# Altium schematic sheet TF_CARD&USB.SchDoc
size A3; Revision: 1.0; SheetNumber: 6; SheetTotal: 7
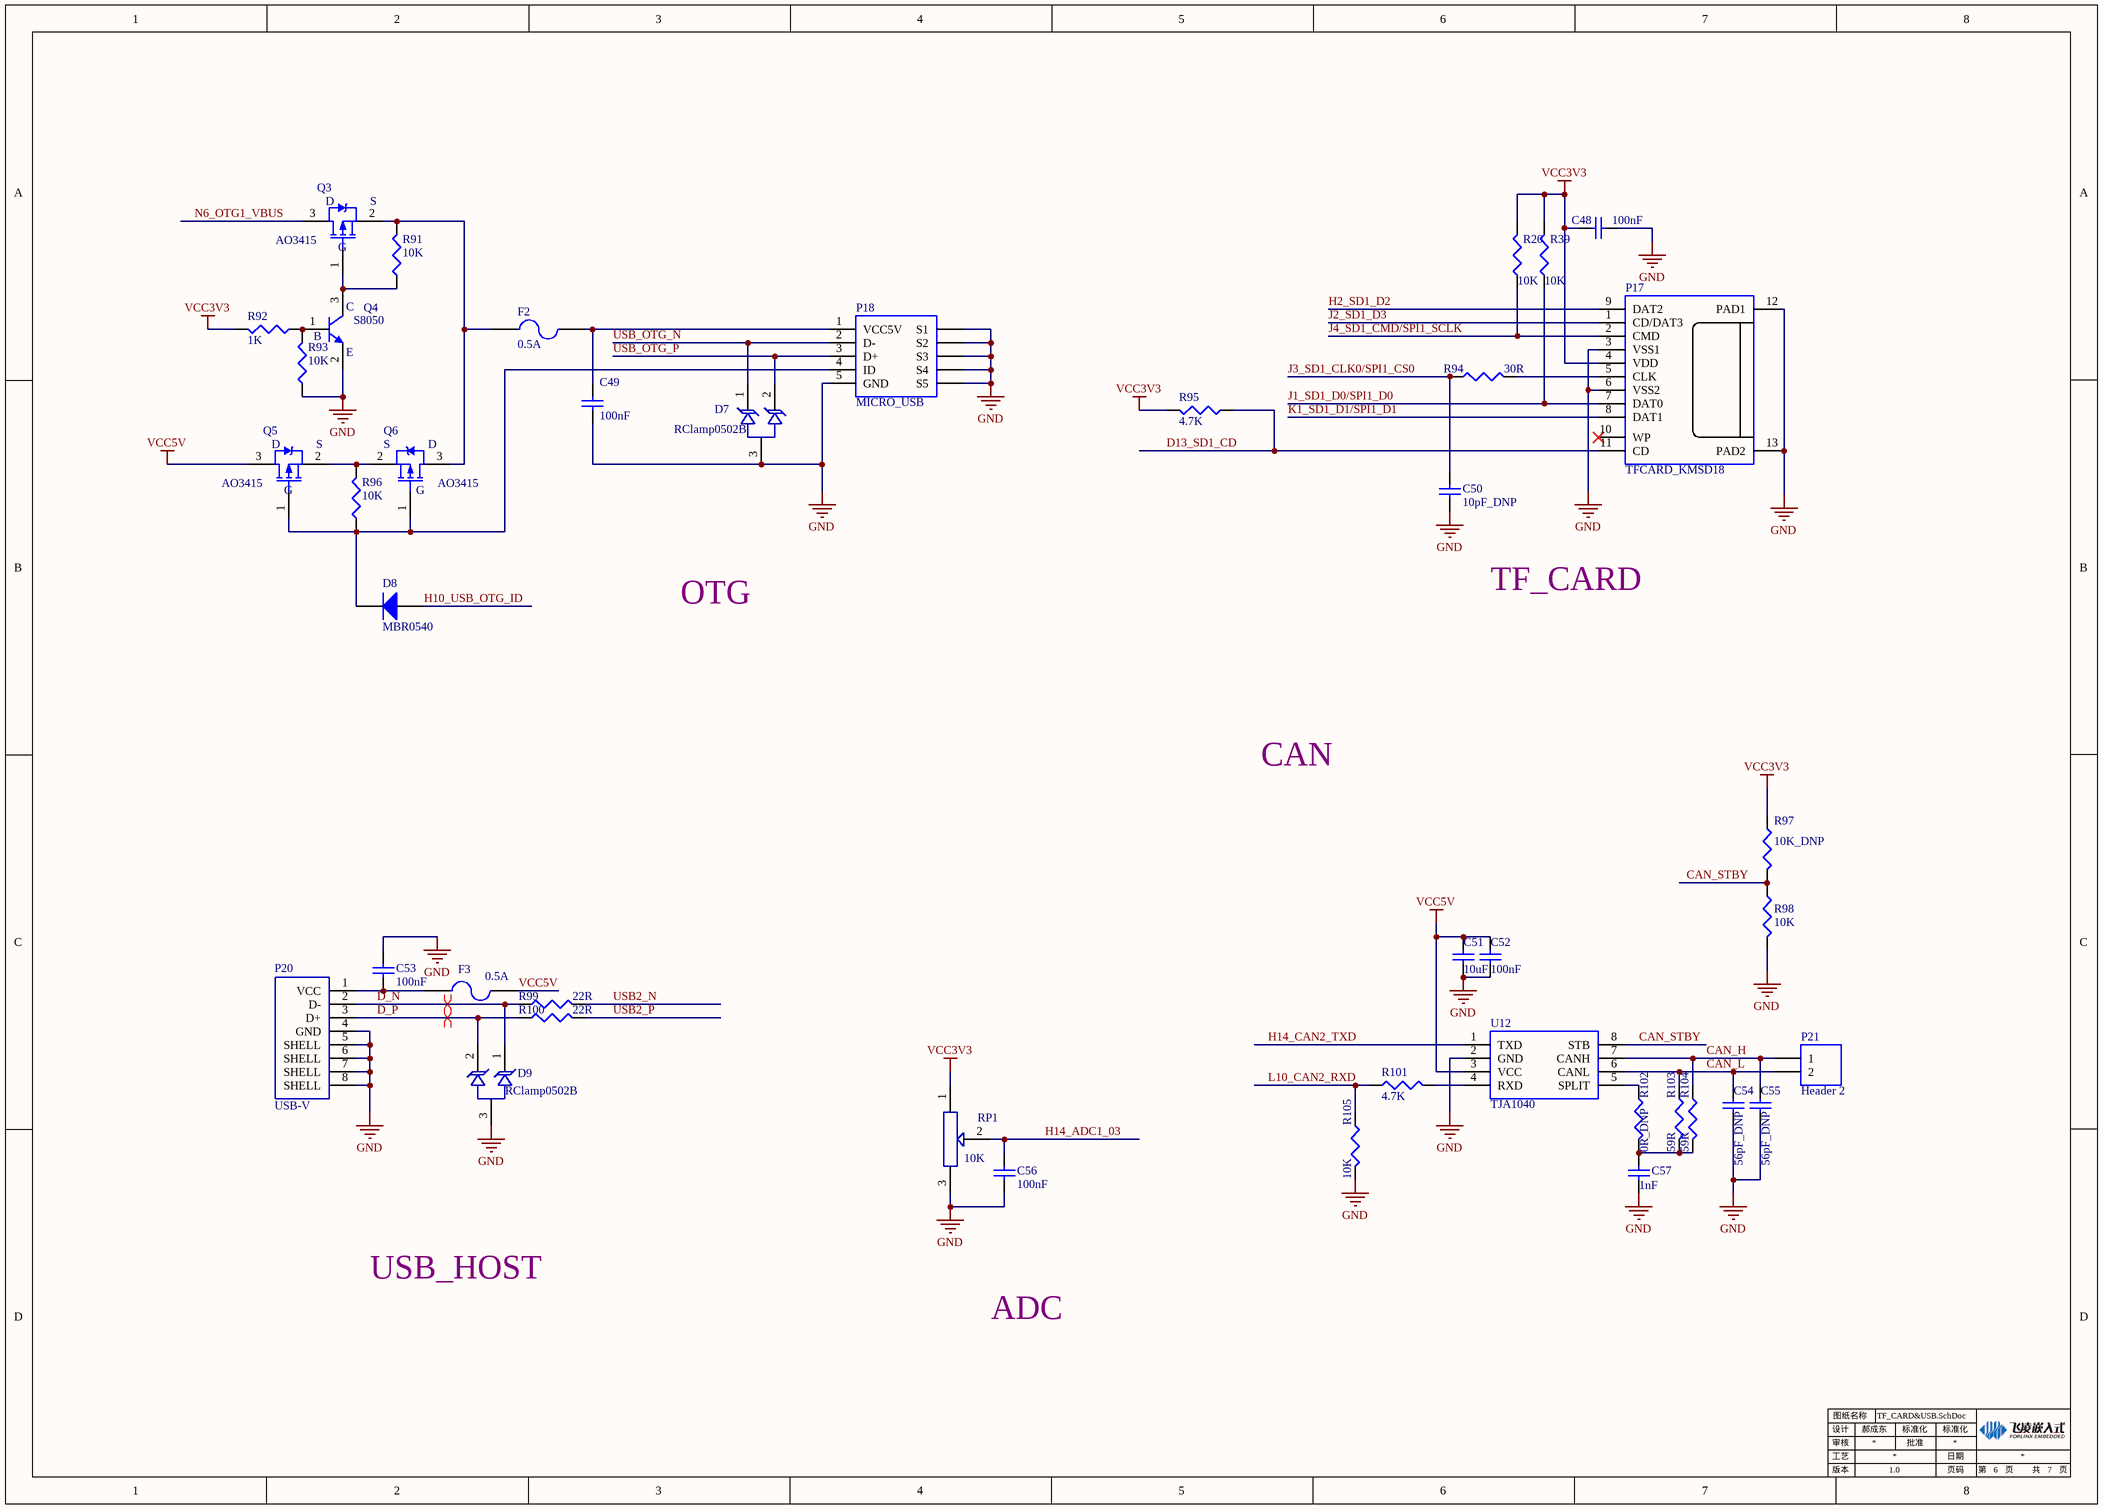
[diagram p0: TF_CARD&USB.SchDoc]

## Parts
C48  100nF  [0603C+]
C49  100nF  [0603C+]
C50  10pF_DNP  [0603C+]
C51  10uF  [0603C+]
C52  100nF  [0603C+]
C53  100nF  [0603C+]
C54  56pF_DNP  [0603C+]
C55  56pF_DNP  [0603C+]
C56  100nF  [0603C+]
C57  1nF  [0603C+]
D7  RClamp0502B  [SOT-523]
D8  MBR0540  [Diode1.6*2.6]
D9  RClamp0502B  [SOT-523]
F2  0.5A  [R_1210]
F3  0.5A  [R_1210]
P17  TFCARD_KMSD18  [TF-CARD]
P18  MICRO_USB  [microUSB]
P20  USB-V  [USB-C]
P21  Header 2  [DG128-2P]
Q3  AO3415  [SOT95P245X110-3N]
Q4  S8050  [SOT95P245X110-3N]
Q5  AO3415  [SOT95P245X110-3N]
Q6  AO3415  [SOT95P245X110-3N]
R20  10K  [0603R+]
R39  10K  [0603R+]
R91  10K  [0603R+]
R92  1K  [0603R+]
R93  10K  [0603R+]
R94  30R  [0603R+]
R95  4.7K  [0603R+]
R96  10K  [0603R+]
R97  10K_DNP  [0603R+]
R98  10K  [0603R+]
R99  22R  [0603R+]
R100  22R  [0603R+]
R101  4.7K  [0603R+]
R102  0R_DNP  [0603R+]
R103  59R  [0603R+]
R104  59R  [0603R+]
R105  10K  [0603R+]
RP1  value 10K  [3296W]  (hidden comment: VR-3296W)
U12  TJA1040  [SOP127P600X175-8N]

## Nets
GND: C48.1 C49.1 C50.2 C51.2 C52.2 C53.1 C54.2 C55.2 C56.1 C57.2 D7.3 D9.3 P17.3(VSS1) P17.6(VSS2) P17.12(PAD1) P17.13(PAD2) P18.5(GND) P18.6(S1) P18.7(S2) P18.8(S3) P18.9(S4) P18.10(S5) P20.4(GND) P20.5(SHELL) P20.6(SHELL) P20.7(SHELL) P20.8(SHELL) Q4.2(E) R93.1 R98.2 R105.2 RP1.3(VCC) U12.2(GND)
VCC3V3: C48.2 P17.4(VDD) R20.2 R39.2 R92.2 R95.2 R97.1 RP1.1(VCC)
VCC5V: C51.1 C52.1 F3.1 Q5.3(D) U12.3(VCC)
CAN_H: C55.1 P21.1 R104.1 U12.7(CANH)
CAN_L: C54.1 P21.2 R103.1 U12.6(CANL)
CAN_STBY: R97.2 R98.1 U12.8(STB)
D13_SD1_CD: P17.11(CD) R95.1
D_N: D9.1 P20.2(D-) R99.1
D_P: D9.2 P20.3(D+) R100.1
H2_SD1_D2: P17.9(DAT2)
H10_USB_OTG_ID: D8.1(A)
H14_ADC1_03: C56.2 RP1.2(VCC)
H14_CAN2_TXD: U12.1(TXD)
J1_SD1_D0/SPI1_D0: P17.7(DAT0) R39.1
J2_SD1_D3: P17.1(CD/DAT3)
J3_SD1_CLK0/SPI1_CS0: C50.1 R94.1
J4_SD1_CMD/SPI1_SCLK: P17.2(CMD) R20.1
K1_SD1_D1/SPI1_D1: P17.8(DAT1)
L10_CAN2_RXD: R101.1 R105.1
N6_OTG1_VBUS: Q3.3(D)
USB2_N: R99.2
USB2_P: R100.2
USB_OTG_N: D7.1 P18.2(D-)
USB_OTG_P: D7.2 P18.3(D+)
NetC49_2: C49.2 F2.1 P18.1(VCC5V)
NetC53_2: C53.2 F3.2 P20.1(VCC)
NetC57_1: C57.1 R102.2 R103.2 R104.2
NetD8_2: D8.2(K) P18.4(ID) Q5.1(G) Q6.1(G) R96.1
NetF2_2: F2.2 Q3.2(S) Q6.3(D) R91.2
NetP17_5: P17.5(CLK) R94.2
NetQ3_1: Q3.1(G) Q4.3(C) R91.1
NetQ4_1: Q4.1(B) R92.1 R93.2
NetQ5_2: Q5.2(S) Q6.2(S) R96.2
NetR101_2: R101.2 U12.4(RXD)
NetR102_1: R102.1 U12.5(SPLIT)

Not connected (* = marked no-connect by the designer): P17 10(WP)*

## Layout directives
differential pair: D_N, D_P

## Notes on the sheet
- OTG
- TF_CARD
- CAN
- USB_HOST
- ADC
- 设计
- 审核
- 工艺
- 图纸名称
- 郝成东
- 批准
- 标准化
- 日期
- 版本
- 页码
- 第
- 页
- 共

## Library data of the parts
C48-C57 = Cap: Capacitor; Published: 8-Jun-2000; LatestRevisionDate: 17-Jul-2002; LatestRevisionNote: Re-released for DXP Platform.; PackageReference: RAD-0.3; Publisher: Altium Limited; PackageDescription: Radial Cap, Thru-Hole; 2 Leads; 0.3 in Pin Spacing
  C48 C49 C52 C53 C56: Value: 100nF
  C50: Value: 10pF_DNP
  C51: Value: 10uF
  C54 C55: Value: 56pF_DNP
  C57: Value: 1nF
D7 D9 = LCTVS: Value: RClamp0502B
D8 = Diode: Default Diode; Published: 8-Jun-2000; LatestRevisionDate: 17-Jul-2002; LatestRevisionNote: Re-released for DXP Platform.; PackageVersion: Sep-1996; PackageReference: SMC; Publisher: Altium Limited; PackageDescription: DO-214-AB/SMC; 2 C-Bend Leads; Body 7.9 x 5.9 mm, inc. leads (LxW); Code_JEDEC: DO-214-AB
F2 F3 = Fuse 2: Fuse; Published: 8-Jun-2000; LatestRevisionDate: 17-Jul-2002; LatestRevisionNote: Re-released for DXP Platform.; PackageReference: PIN-W2/E2.8; Publisher: Altium Limited; PackageDescription: Thru-Hole; 2 Leads; Value: 0.5A
P17 = SDCARD_KMSD18
P18 = MICRO_USB: Header, 5-Pin, Dual row; LatestRevisionDate: 17-Jul-2002; LatestRevisionNote: Re-released for DXP Platform.; Publisher: Altium Limited; VALUE: MICRO_USB
Q3 Q5 Q6 = PMOS: N-Channel Power MOSFET; Note: Pin 2 is electrically connected to pin 4.; Published: 8-Jun-2000; LatestRevisionDate: 17-Jul-2002; LatestRevisionNote: Re-released for DXP Platform.; DatasheetVersion: PD-9.814; PackageVersion: Feb-1997; PackageReference: TO-220AB; Publisher: Altium Limited; PackageDescription: TO, Thru-Hole, Vertical, Heatsink Mounted; 3 In-Line Leads; Pitch 2.54 mm; ComponentLink1Description: Manufacturer Link; ComponentLink1URL: http://www.irf.com/; VALUE: AO3415
Q4 = NPN: NPN Bipolar Transistor; Published: 8-Jun-2000; LatestRevisionDate: 17-Jul-2002; LatestRevisionNote: Re-released for DXP Platform.; PackageReference: TO-226-AA; Publisher: Altium Limited; PackageDescription: TO, Flat Index; 3 In-Line, Axial Leads; Body Dia. 4.8mm; Leads 0.55 x 0.51 mm (max); Code_JEDEC: TO-226-AA; VALUE: S8050
R20 R39 R91-R105 = Res3: Resistor; Published: 8-Jun-2000; LatestRevisionDate: 29-May-2009; LatestRevisionNote: IPC-7351 Footprint Added.; PackageReference: J1-0603; Publisher: Altium Limited; PackageDescription: Chip Resistor
  R20 R39 R91 R93 R96 R98 R105: Value: 10K
  R92: Value: 1K
  R94: Value: 30R
  R95 R101: Value: 4.7K
  R97: Value: 10K_DNP
  R99 R100: Value: 22R
  R102: Value: 0R_DNP
  R103 R104: Value: 59R
RP1 = VR